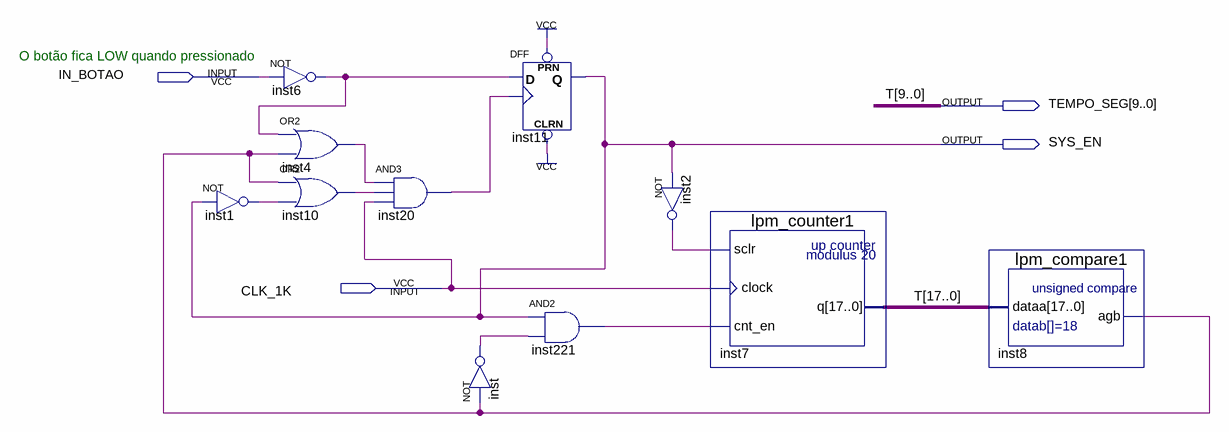
[diagram p0: schematic sheet]
// Quartus schematic contador_180.bdf as structural Verilog: 11 symbols, 4 pins
module contador_180 (
  input  IN_BOTAO,
  input  CLK_1K,
  output [9:0] TEMPO_SEG,
  output SYS_EN
);

  wire inst1_out, inst2_out, inst4_out, inst6_out, inst8_agb, inst10_out, inst20_out, inst221_out, inst_out;
  wire [17:10] T;

  not inst6 (inst6_out, IN_BOTAO);
  not inst1 (inst1_out, SYS_EN);
  or inst4 (inst4_out, inst6_out, inst8_agb);
  or inst10 (inst10_out, inst8_agb, inst1_out);
  and inst20 (inst20_out, inst4_out, inst10_out, CLK_1K);
  not inst (inst_out, inst8_agb);
  DFF inst11 (.CLRN(1'b1), .CLK(inst20_out), .D(inst6_out), .PRN(1'b1), .Q(SYS_EN));
  and inst221 (inst221_out, SYS_EN, inst_out);
  not inst2 (inst2_out, SYS_EN);
  lpm_counter1 inst7 (.sclr(inst2_out), .clock(CLK_1K), .cnt_en(inst221_out), .q({T, TEMPO_SEG}));
  lpm_compare1 inst8 (.dataa({T, TEMPO_SEG}), .agb(inst8_agb));

  // Other names for the same wires on the sheet: T[9:0] = TEMPO_SEG

  // Notes on the sheet:
  //   O botão fica LOW quando pressionado
endmodule
